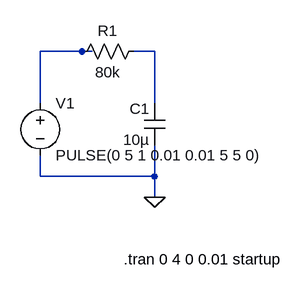
[diagram p0: schematic simulation.asc]
simulation.asc, the LTspice schematic file:
Version 4
SHEET 1 880 680
WIRE 0 48 -64 48
WIRE 16 48 0 48
WIRE 112 48 80 48
WIRE -64 128 -64 48
WIRE 112 128 112 48
WIRE -64 240 -64 208
WIRE 112 240 112 192
WIRE 112 240 -64 240
WIRE 112 272 112 240
FLAG 112 272 0
SYMBOL voltage -64 112 R0
WINDOW 123 0 0 Left 0
WINDOW 39 0 0 Left 0
SYMATTR InstName V1
SYMATTR Value PULSE(0 5 1 0.01 0.01 5 5 0)
SYMBOL cap 128 192 R180
WINDOW 0 24 56 Left 2
WINDOW 3 24 8 Left 2
SYMATTR InstName C1
SYMATTR Value 10µ
SYMBOL res -16 64 R270
WINDOW 0 32 56 VTop 2
WINDOW 3 0 56 VBottom 2
SYMATTR InstName R1
SYMATTR Value 80k
TEXT 64 368 Left 2 !.tran 0 4 0 0.01 startup

The netlist it stands for:
* simulation.asc
V1 N001 0 PULSE(0 5 1 0.01 0.01 5 5 0)
C1 0 N002 10µ
R1 N001 N002 80k
.tran 0 4 0 0.01 startup
.backanno
.end